# EasyEDA Pro project 通用采样.eprj, board 互感器
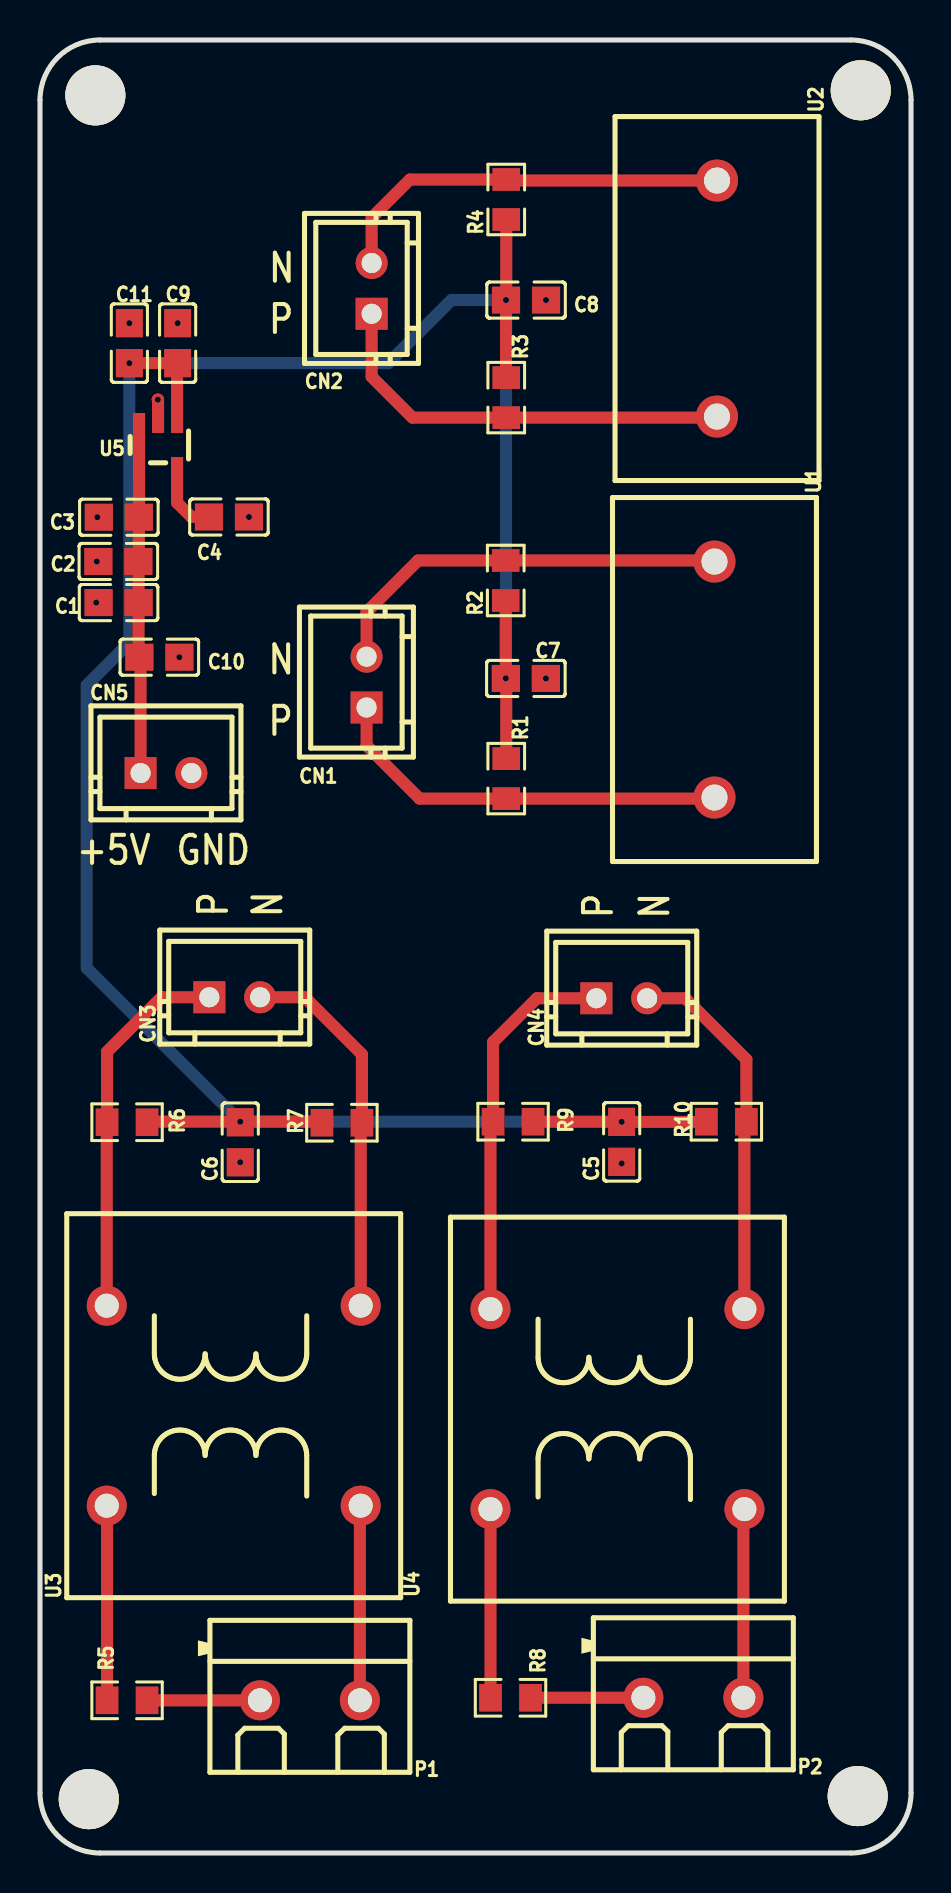
[diagram p10: board, top side]
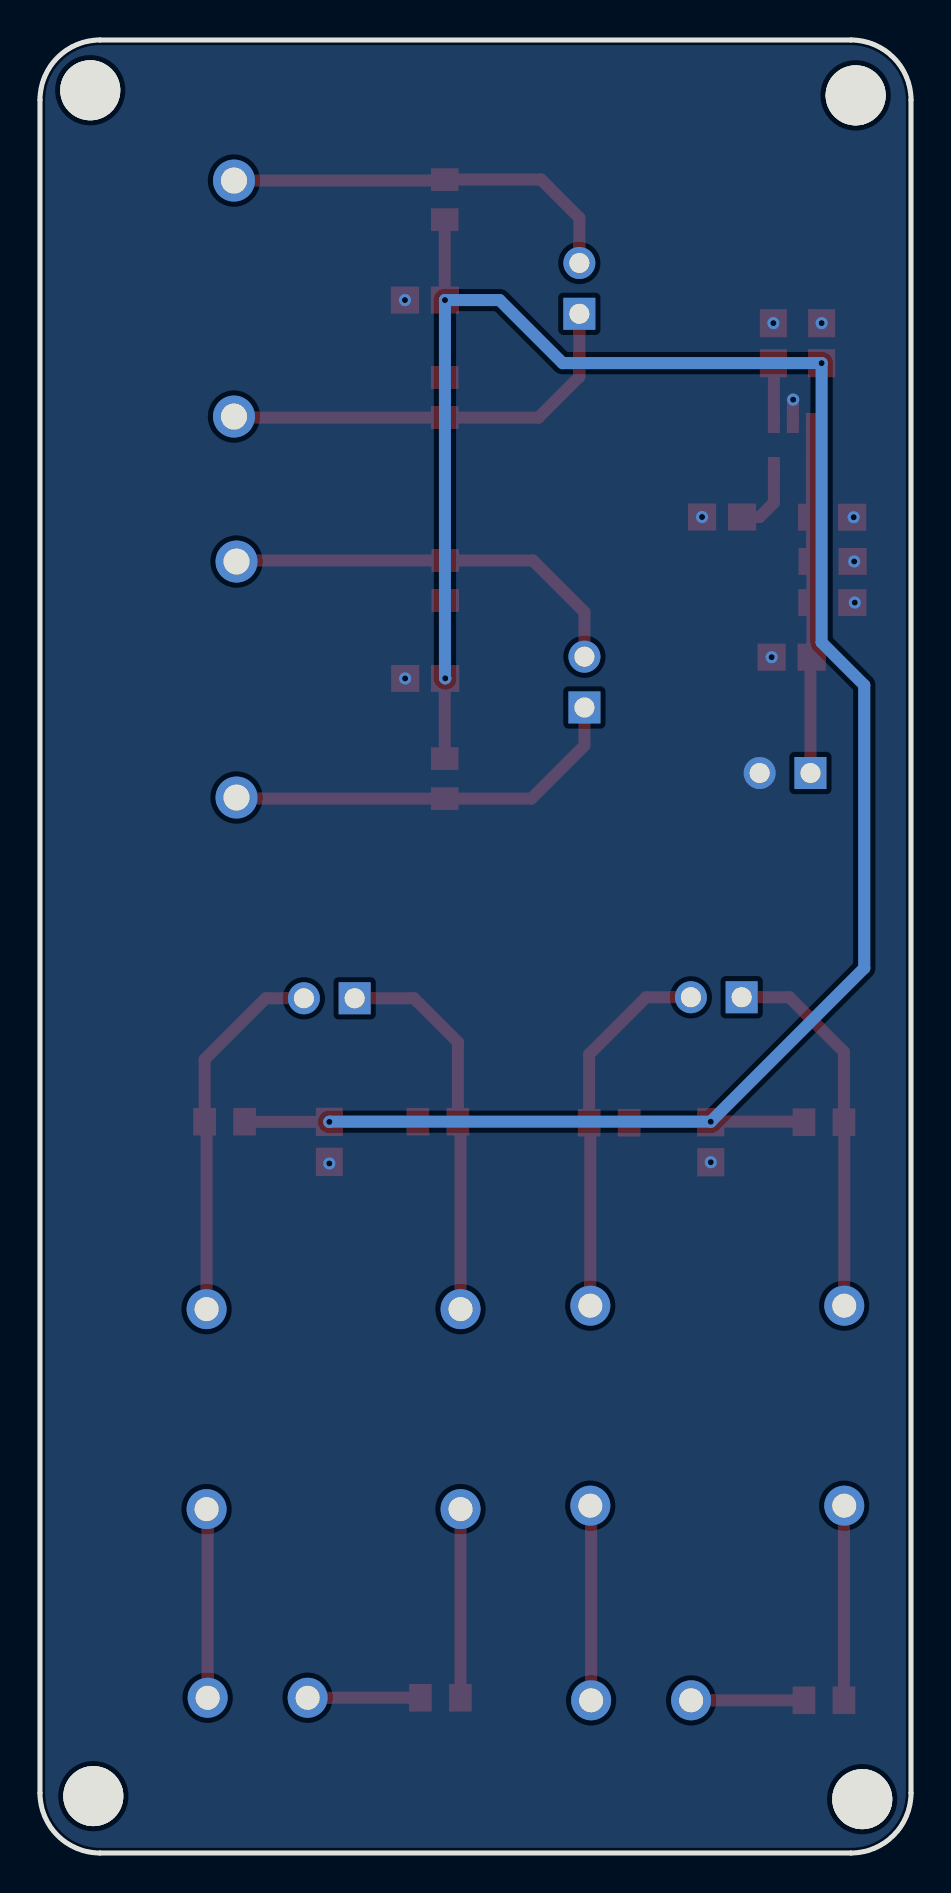
[diagram p11: board, bottom side, seen from below]

Outline 43.56 x 90.65 mm; copper layers: Top Layer, Bottom Layer. Coordinates in mm from the lower left corner of the outline.
Outline path: 0,87.65 arc(0.88,89.77) 3,90.65 40.56,90.65 arc(42.68,89.77) 43.56,87.65 43.56,3 arc(42.68,0.88) 40.56,0 3,0 arc(0.88,0.88) 0,3 0,87.65
Stack: Top Layer 0.035mm / Dielectric1 1.51mm FR4 er 4.5 / Bottom Layer 0.035mm

## Design rules (mm)
template: 自定义配置
spacing copperThickness1oz (default): track to track 0.102, other pairs 0.152 to 0.3
spacing copperThickness2oz: track to track 0.203, other pairs 0.152 to 0.3
track width copperThickness1oz (default): min 0.127, default 0.254, max 2.54
track width copperThickness2oz: min 0.203, default 0.254, max 2.54
differential pair differentialPair (default): width min 0.127, default 0.254, max 2.54; gap min 0.152, default 0.152
via viaSize (default): diameter min 0.5, default 0.61, max 10; hole min 0.3, default 0.305, max 6.3

## Placement (name value [footprint] x y rotation side)
C1  100nF  [C0805]  3.93 62.52 0 top
C2  100nF  [C0805]  3.92 64.58 0 top
C3  100nF  [C0805]  3.94 66.79 0 top
C4  100nF  [C0805]  9.45 66.8 180 top
C5  100nF  [C0805]  29.09 35.56 90 top
C6  100nF  [C0805]  10.02 35.54 90 top
C7  100nF  [C0805]  24.3 58.73 180 top
C8  100nF  [C0805]  24.31 77.65 180 top
C9  100nF  [C0805]  6.88 75.49 270 top
C10  100nF  [C0805]  5.97 59.79 180 top
C11  1uF  [C0805]  4.47 75.49 270 top
CN1  CON2-2.54*2P  [CONN-TH_2P-P2.54-V]  16.33 58.55 90 top
CN2  CON2-2.54*2P  [CONN-TH_2P-P2.54-V]  16.59 78.23 90 top
CN3  CON2-2.54*2P  [CONN-TH_2P-P2.54-V]  9.74 42.79 0 top
CN4  CON2-2.54*2P  [CONN-TH_2P-P2.54-V]  29.09 42.74 0 top
CN5  CON2-2.54*2P  [CONN-TH_2P-P2.54-V]  6.3 54 0 top
NOREF  -  [Pad_e364]  40.89 2.84 0 top
NOREF#2  -  [Pad_e362]  41.05 88.14 0 top
NOREF#3  -  [Pad_e365]  2.44 2.69 90 top
NOREF#4  -  [Pad_e366]  2.77 87.88 90 top
P1  KF301-2P接线端子  [CONN-TH_XY301V-A-5.0-2P]  13.5 7.64 180 top
P2  KF301-2P接线端子  [CONN-TH_XY301V-A-5.0-2P]  32.68 7.76 180 top
R1  10K  [R0805]  23.32 53.72 270 top
R2  10K  [R0805]  23.29 63.63 90 top
R3  10K  [R0805]  23.32 72.77 270 top
R4  10K  [R0805]  23.32 82.68 90 top
R5  10K  [R0805]  4.35 7.64 0 top
R6  10K  [R0805]  4.35 36.54 180 top
R7  10K  [R0805]  15.1 36.51 0 top
R8  10K  [R0805]  23.53 7.76 0 top
R9  10K  [R0805]  23.66 36.57 180 top
R10  10K  [R0805]  34.33 36.57 0 top
U1  ZMCT103C  [XFMR-TH_ZMCT103C]  33.73 58.67 270 top
U2  ZMCT103C  [XFMR-TH_ZMCT103C]  33.86 77.72 270 top
U3  ZMPT101B  [XFMR-TH_ZMPT101B]  9.69 22.37 90 top
U4  ZMPT101B  [XFMR-TH_ZMPT101B]  28.88 22.19 90 top
U5  REF2030AIDDCR  [SOT-23-5_L2.9-W1.6-P0.95-LS2.8-BL]  5.91 70.4 180 top

## Footprints (pads in the part's own frame, mm; a bottom-side part is the same pattern mirrored in y, then rotated)
C0805
  rect 1.41x1.35 smd: 1(-1,0) 2(1,0)
CONN-TH_2P-P2.54-V
  rect 1.6x1.6 hole 1: 1(-1.27,0)
  round 1.6 hole 1: 2(1.27,0)
CONN-TH_XY301V-A-5.0-2P
  round 2 hole 1.2: 1(-2.5,0) 2(2.5,0)
Pad_e362
  round 3 hole 3: 1(0,0)
Pad_e364
  round 3 hole 3: 1(0,0)
Pad_e365
  round 3 hole 3: 1(0,0)
Pad_e366
  round 3 hole 3: 2(0,0)
R0805
  rect 1.133x1.377 smd: 1(-1,0) 2(1,0)
SOT-23-5_L2.9-W1.6-P0.95-LS2.8-BL
  rect 0.6x1 smd: 1(-0.95,-1.1) 2(0,-1.1) 3(0.95,-1.1) 4(0.95,1.1) 5(-0.95,1.1)
XFMR-TH_ZMCT103C
  round 2.1 hole 1.3: 1(-5.9,0) 2(5.9,0)
XFMR-TH_ZMPT101B
  round 2 hole 1.2: 1(-5,6.35) 2(-5,-6.35) 3(5,-6.35) 4(5,6.35)

## Nets
As in the schematic.

Pads without a net: NOREF 1; NOREF#2 1; NOREF#3 1; NOREF#4 2

## Via types
v1: diameter 0.61, hole 0.305, Top Layer to Bottom Layer, 17 vias

## Routing (per net, layer and track width the routed paths; a pad name or vN(x,y) marks a point on that pad's centre or on a via; arc(x,y) is an arc through that point)
3V: length 3.7
  Top Layer w0.6: C4.2 7.57,66.8 6.86,67.52 U5.5
+1.5V: length 138.8
  Top Layer w0.6: R6.1 5.38,36.57 v1(10.02,36.57) 14.05,36.57 R7.1 ; R9.1 29.08,36.57 v1(29.09,36.56) 33.32,36.56 R10.1 ; R4.1 23.32,77.66 v1(23.31,77.65) 23.31,73.78 R3.1 ; R1.1 23.32,58.71 C7.2 v1(23.29,58.74) R2.1 ; U5.1 6.86,74.47 C9.2 v1(4.47,74.49)
  Bottom Layer w0.6: v1(23.29,58.74) 23.31,58.75 v1(23.31,77.65) 20.57,77.65 17.42,74.49 v1(4.47,74.49) 4.47,60.53 2.34,58.4 2.34,44.24 v1(10.02,36.57) 29.08,36.57 v1(29.09,36.56)
+5V: length 17.6
  Top Layer w0.6: CN5.1 5.03,59.73 C10.2 4.93,59.83 C1.2 4.93,64.57 C2.2 4.94,64.6 C3.2 4.96,66.8 U5.4 U5.3
GND: length 1.2
  Top Layer w0.6: U5.2 5.91,72.66 v1(5.89,72.67)
  vias: v1(2.84,64.58) v1(2.81,62.52) v1(2.87,66.79) v1(4.47,76.49) v1(6.88,76.49) v1(6.97,59.79) v1(10.02,34.54) v1(10.45,66.8) v1(25.31,77.65) v1(25.3,58.73) v1(29.09,34.48)
$1N495: length 20.4
  Top Layer w0.6: CN1.1 16.33,55.37 18.98,52.72 R1.2 33.68,52.72 U1.2
$1N507: length 20.7
  Top Layer w0.6: CN1.2 16.33,62.05 18.91,64.63 R2.2 33.68,64.63 U1.1
$1N515: length 21.3
  Top Layer w0.6: U2.2 33.81,71.77 R3.2 18.63,71.77 16.59,73.81 CN2.1
$1N524: length 20.3
  Top Layer w0.6: U2.1 23.37,83.62 R4.2 18.5,83.68 16.59,81.76 CN2.2
$1N529: length 18.9
  Top Layer w0.6: 3.34,27.37 3.34,36.52 R6.2 3.35,40.06 6.08,42.79 CN3.1
$1N534: length 18.9
  Top Layer w0.6: CN3.2 13.24,42.79 16.1,39.93 R7.2 16.04,36.45 16.04,27.37
$1N544: length 19.5
  Top Layer w0.6: CN4.1 24.85,42.74 22.66,40.54 R9.2 22.53,36.44 U4.4
$1N549: length 18.8
  Top Layer w0.6: U4.3 35.23,36.47 R10.2 35.33,39.68 32.27,42.74 CN4.2
$1N697: length 5.6
  Top Layer w0.6: P1.2 R5.2
$1N703: length 9.7
  Top Layer w0.6: U3.1 3.35,17.35 R5.1
$1N708: length 9.7
  Top Layer w0.6: U3.2 16,17.33 P1.1
$1N718: length 9.4
  Top Layer w0.6: U4.1 22.53,17.19 R8.1
$1N2944: length 9.5
  Top Layer w0.6: U4.2 35.18,17.14 P2.1
$1N2949: length 5.6
  Top Layer w0.6: R8.2 P2.2

## Copper pours and planes (outline as drawn; the poured copper is in the pictures)
GND on Bottom Layer: -1.08,-0.79 -1.08,90.92 44.32,90.92 44.32,-0.79

## Text on the board
Top Silkscreen Layer: +5V | GND | N | P
